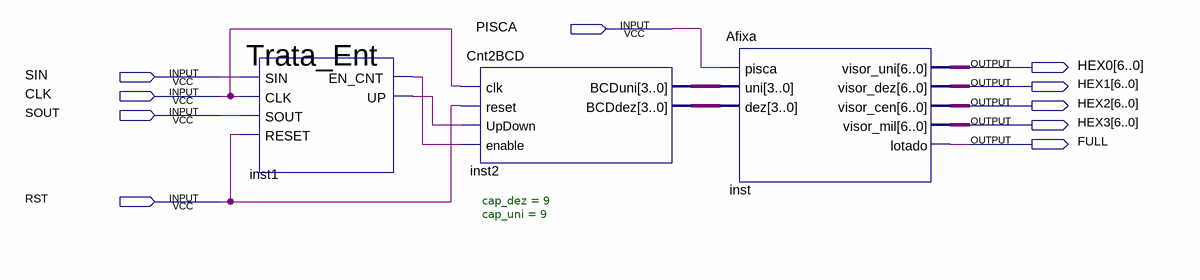
[diagram p0: schematic sheet]
// Quartus schematic Ocupacao.bdf as structural Verilog: 3 symbols, 10 pins
module Ocupacao (
  input  PISCA,
  input  SIN,
  input  CLK,
  input  SOUT,
  input  RST,
  output [6:0] HEX0,
  output [6:0] HEX1,
  output [6:0] HEX2,
  output [6:0] HEX3,
  output FULL
);

  wire inst1_en_cnt, inst1_up;
  wire [3:0] inst2_bcddez, inst2_bcduni;

  Trata_Ent inst1 (.SIN(SIN), .CLK(CLK), .SOUT(SOUT), .RESET(RST), .EN_CNT(inst1_en_cnt), .UP(inst1_up));
  Cnt2BCD #(.cap_dez(9), .cap_uni(9)) inst2 (
    .clk(CLK), .reset(RST), .UpDown(inst1_up), .enable(inst1_en_cnt), .BCDuni(inst2_bcduni),
    .BCDdez(inst2_bcddez));
  Afixa inst (
    .pisca(PISCA), .uni(inst2_bcduni), .dez(inst2_bcddez), .visor_uni(HEX0), .visor_dez(HEX1),
    .visor_cen(HEX2), .visor_mil(HEX3), .lotado(FULL));
endmodule
